# EAGLE design base-1u-video (EAGLE 4.16)
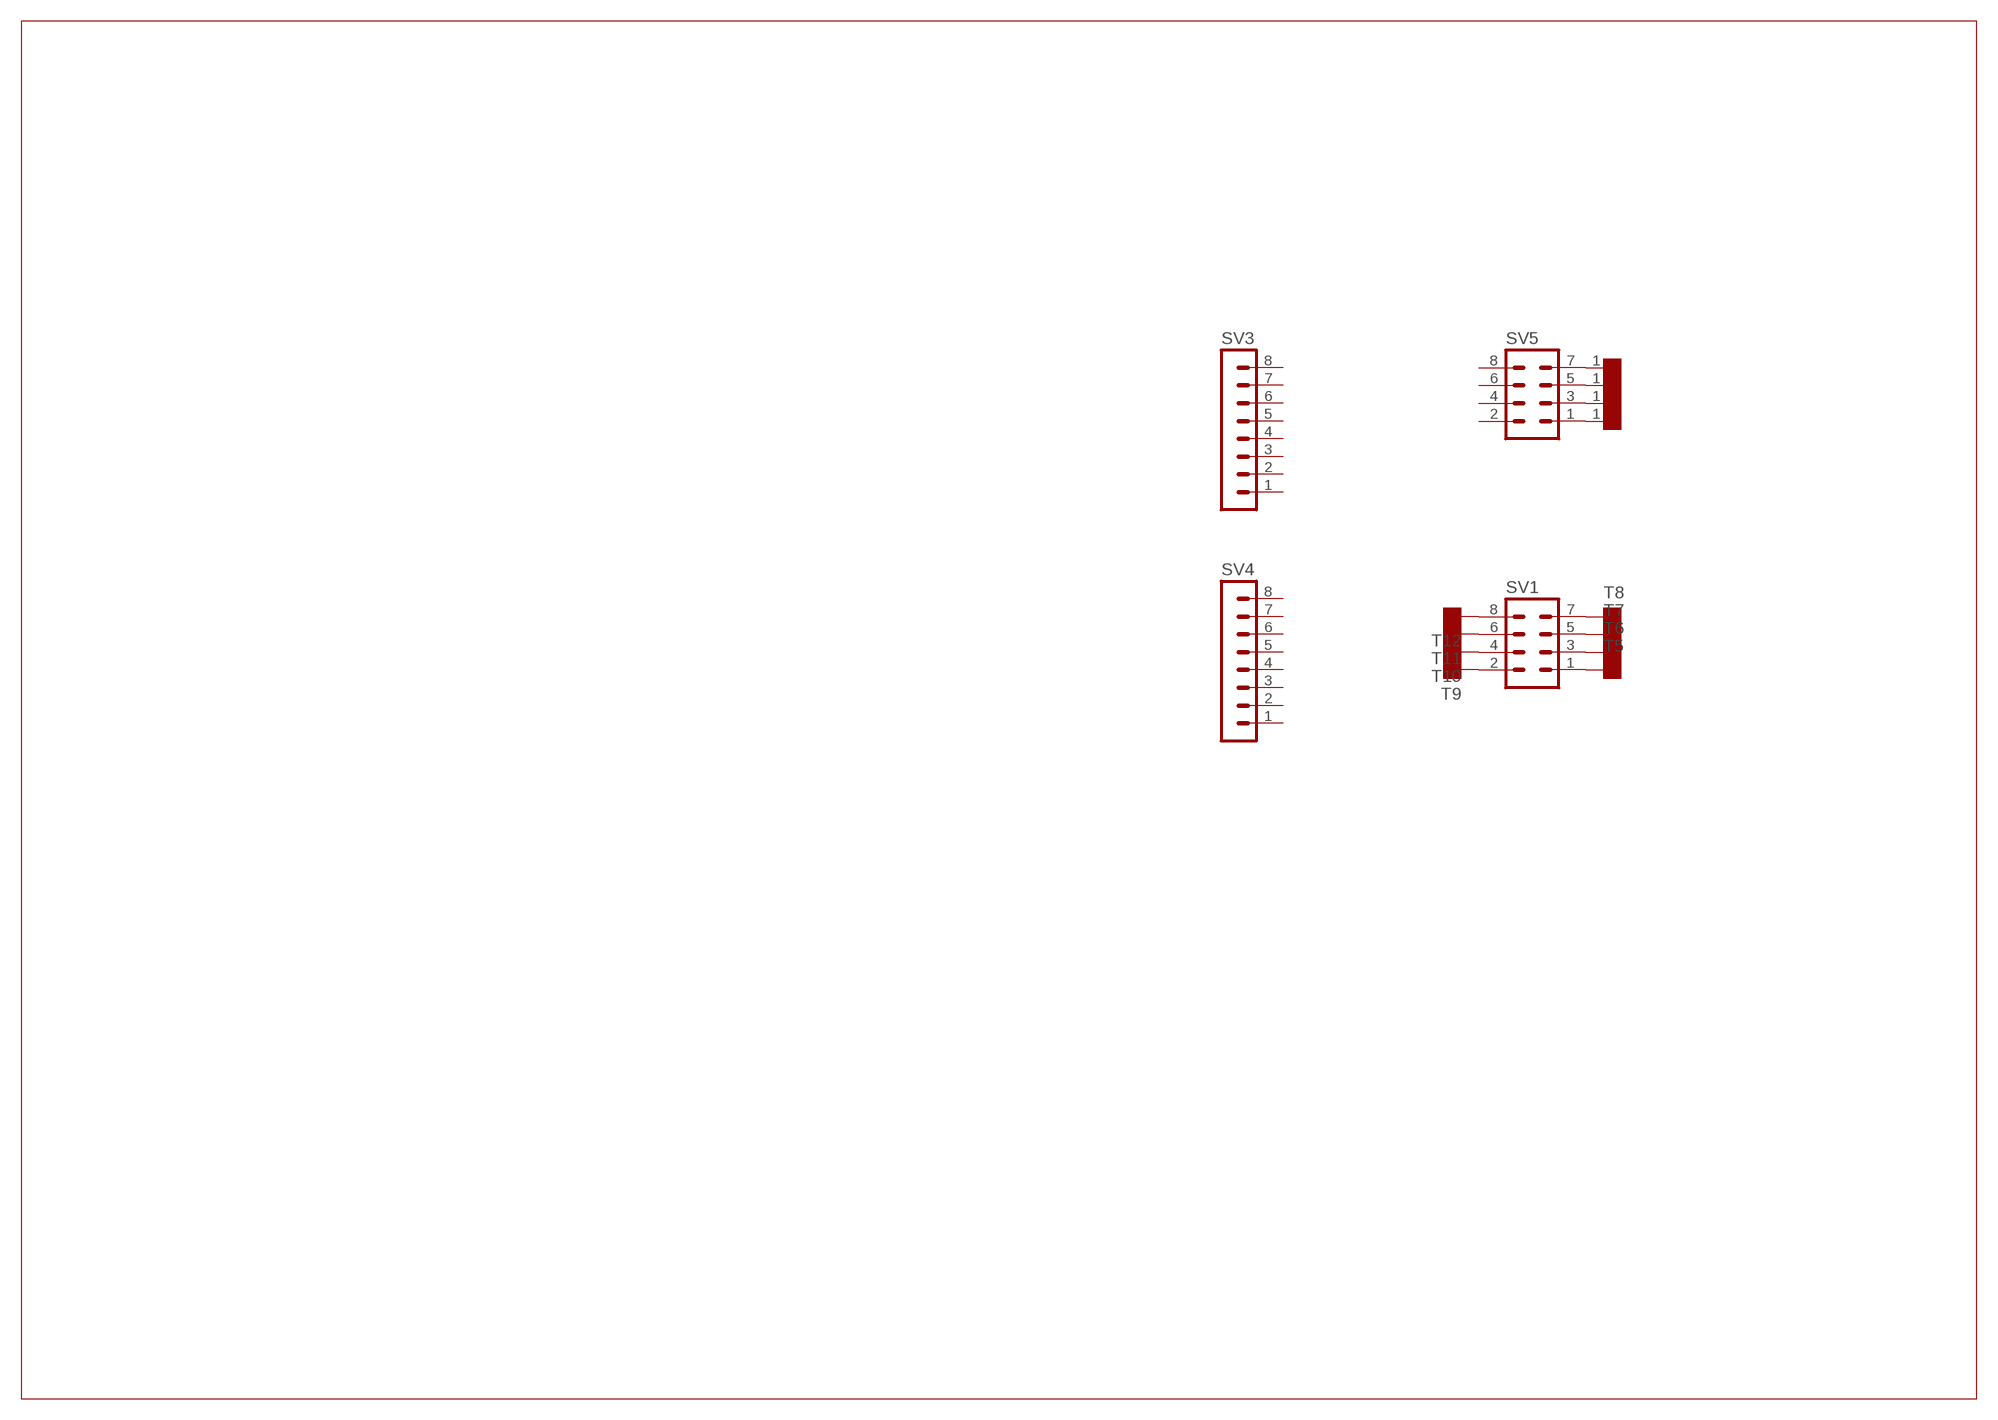
[diagram p0: schematic, sheet 1]

## Parts
SV1  MA04-2  [MA04-2]
SV3  MA08-1  [MA08-1]
SV4  MA08-1  [MA08-1]
SV5  MA04-2  [MA04-2]
T1  TESTPOINT  [TESTPOIN]
T2  TESTPOINT  [TESTPOIN]
T3  TESTPOINT  [TESTPOIN]
T4  TESTPOINT  [TESTPOIN]
T5  TESTPOINTAWG24  [HOLEAWG24]
T6  TESTPOINTAWG24  [HOLEAWG24]
T7  TESTPOINTAWG24  [HOLEAWG24]
T8  TESTPOINTAWG24  [HOLEAWG24]
T9  TESTPOINTAWG24  [HOLEAWG24]
T10  TESTPOINTAWG24  [HOLEAWG24]
T11  TESTPOINTAWG24  [HOLEAWG24]
T12  TESTPOINTAWG24  [HOLEAWG24]

## Nets
N$129: SV1.1 T5.P$1
N$130: SV1.3 T6.P$1
N$131: SV1.5 T7.P$1
N$132: SV1.7 T8.P$1
N$133: SV1.2 T9.P$1
N$134: SV1.4 T10.P$1
N$135: SV1.6 T11.P$1
N$136: SV1.8 T12.P$1
N$137: SV5.1 T1.1
N$138: SV5.3 T2.1
N$139: SV5.5 T3.1
N$140: SV5.7 T4.1
Unconnected: SV3.1 SV3.2 SV3.3 SV3.4 SV3.5 SV3.6 SV3.7 SV3.8 SV4.1 SV4.2 SV4.3 SV4.4 SV4.5 SV4.6 SV4.7 SV4.8 SV5.2 SV5.4 SV5.6 SV5.8

## Library data of the parts
SV1 SV5 = con-lstb:MA04-2: PIN HEADER
SV3 SV4 = con-lstb:MA08-1: PIN HEADER
T1-T4 = ADS:TESTPOINT
T5-T12 = ads4:TESTPOINT: Test point

## Board
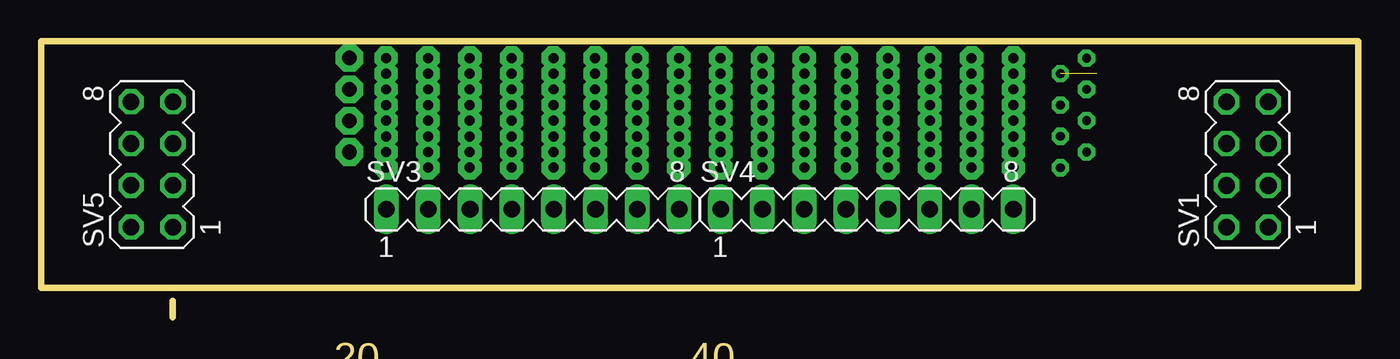
[diagram p1: board, top side]
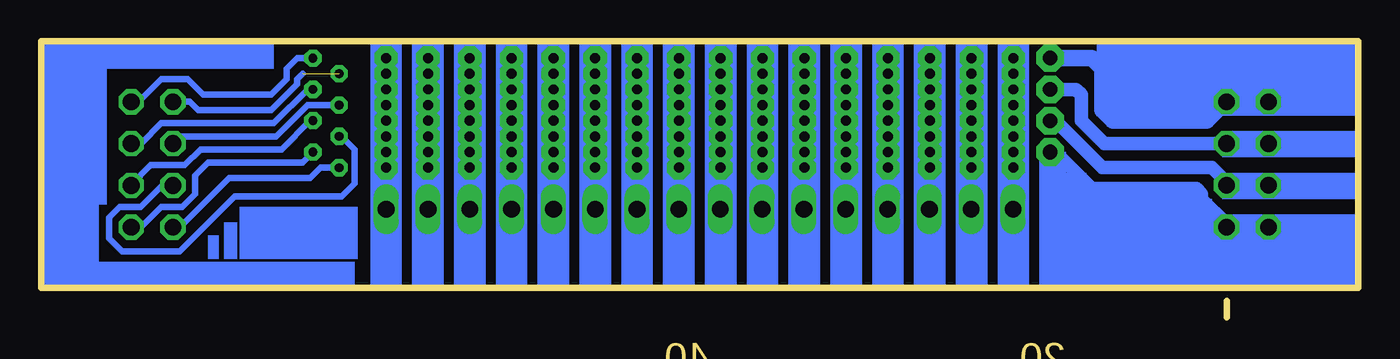
[diagram p2: board, bottom side, seen from below]

Size 80 x 16.8 mm. Coordinates in mm from the lower left corner, seen from the top.
Outline: 8,1 8,0
Outline: 0,1.8 80,1.8 80,16.8 0,16.8 0,1.8
Copper layers (1*16): Top 0.035mm / dielectric 1.5mm / Bottom 0.035mm
Design rules "default": minimum track width 10mil, minimum drill 24mil, track to track 8mil, track to pad 8mil, pad to pad 8mil, via to via 8mil, smd to smd 8mil, copper to edge 40mil, drill to drill 8mil, minimum pad ring 10mil, minimum via ring 8mil, stop-mask expansion 4mil, vias tented up to drill 0mil, thermal gap 10mil

### Footprints (pad centres in the part's own frame; a part is rotated, then mirrored left to right if it is on the bottom)
MA04-2 = drill 1.016 octagon: 1 -3.81,-1.27; 2 -3.81,1.27; 3 -1.27,-1.27; 4 -1.27,1.27; 5 1.27,-1.27; 6 1.27,1.27; 7 3.81,-1.27; 8 3.81,1.27
MA08-1 = drill 1.016 long: 1 -8.89,0; 2 -6.35,0; 3 -3.81,0; 4 -1.27,0; 5 1.27,0; 6 3.81,0; 7 6.35,0; 8 8.89,0
TESTPOIN = drill 0.889 pad 1.676 octagon: 1 0,0
HOLEAWG24 = drill 0.533 pad 0.787 octagon: P$1 0,0

### Placement (x,y rotation side)
SV1  73.27,9.3 90 top
SV3  29.86,6.57 0 top
SV4  50.16,6.57 0 top
SV5  6.73,9.3 90 top
T1  18.73,10.06 0 top
T2  18.73,11.96 0 top
T3  18.73,13.87 0 top
T4  18.73,15.77 0 top
T5  63.5,10.06 0 top
T6  63.5,11.96 0 top
T7  63.5,13.87 0 top
T8  63.5,15.77 0 top
T9  61.91,9.1 0 top
T10  61.91,11.01 0 top
T11  61.91,12.91 0 top
T12  61.91,14.82 0 top

### Tracks (layer width: path | path; a pad name or v marks a point on that pad's centre or on a via)
N$1  (via drill 0.6 pad 1.42)
  other vias: 20.95,9.1
N$2  (via drill 0.6 pad 1.42)
  other vias: 20.95,10.06
N$3  (via drill 0.6 pad 1.42)
  other vias: 20.95,11.01
N$4  (via drill 0.6 pad 1.42)
  other vias: 20.95,11.96
N$5  (via drill 0.6 pad 1.42)
  other vias: 23.5,9.1
N$6  (via drill 0.6 pad 1.42)
  other vias: 23.5,11.01
N$7  (via drill 0.6 pad 1.42)
  other vias: 23.5,12.91
N$8  (via drill 0.6 pad 1.42)
  other vias: 23.5,14.82
N$9  (via drill 0.6 pad 1.42)
  other vias: 20.95,12.91
N$10  (via drill 0.6 pad 1.42)
  other vias: 20.95,13.87
N$11  (via drill 0.6 pad 1.42)
  other vias: 20.95,14.82
N$12  (via drill 0.6 pad 1.42)
  other vias: 20.95,15.77
N$13  (via drill 0.6 pad 1.42)
  other vias: 33.66,9.1
N$14  (via drill 0.6 pad 1.42)
  other vias: 33.66,11.01
N$15  (via drill 0.6 pad 1.42)
  other vias: 33.66,12.91
N$16  (via drill 0.6 pad 1.42)
  other vias: 33.66,14.82
N$17  (via drill 0.6 pad 1.42)
  other vias: 23.5,15.77
N$18  (via drill 0.6 pad 1.42)
  other vias: 23.5,13.87
N$19  (via drill 0.6 pad 1.42)
  other vias: 23.5,11.96
N$20  (via drill 0.6 pad 1.42)
  other vias: 23.5,10.06
N$21  (via drill 0.6 pad 1.42)
  other vias: 33.66,15.77
N$22  (via drill 0.6 pad 1.42)
  other vias: 33.66,13.87
N$23  (via drill 0.6 pad 1.42)
  other vias: 33.66,11.96
N$24  (via drill 0.6 pad 1.42)
  other vias: 33.66,10.06
N$25  (via drill 0.6 pad 1.42)
  other vias: 31.11,9.1
N$26  (via drill 0.6 pad 1.42)
  other vias: 31.11,10.06
N$27  (via drill 0.6 pad 1.42)
  other vias: 31.11,11.01
N$28  (via drill 0.6 pad 1.42)
  other vias: 31.11,11.96
N$29  (via drill 0.6 pad 1.42)
  other vias: 38.73,9.1
N$30  (via drill 0.6 pad 1.42)
  other vias: 38.73,10.06
N$31  (via drill 0.6 pad 1.42)
  other vias: 38.73,11.01
N$32  (via drill 0.6 pad 1.42)
  other vias: 38.73,11.96
N$33  (via drill 0.6 pad 1.42)
  other vias: 41.27,9.1
N$34  (via drill 0.6 pad 1.42)
  other vias: 41.27,11.01
N$35  (via drill 0.6 pad 1.42)
  other vias: 41.27,12.91
N$36  (via drill 0.6 pad 1.42)
  other vias: 41.27,14.82
N$37  (via drill 0.6 pad 1.42)
  other vias: 43.81,10.06
N$38  (via drill 0.6 pad 1.42)
  other vias: 43.81,11.96
N$39  (via drill 0.6 pad 1.42)
  other vias: 43.81,13.87
N$40  (via drill 0.6 pad 1.42)
  other vias: 43.81,15.77
N$41  (via drill 0.6 pad 1.42)
  other vias: 46.35,9.1
N$42  (via drill 0.6 pad 1.42)
  other vias: 46.35,11.01
N$43  (via drill 0.6 pad 1.42)
  other vias: 46.35,12.91
N$44  (via drill 0.6 pad 1.42)
  other vias: 46.35,14.82
N$45  (via drill 0.6 pad 1.42)
  other vias: 48.9,10.06
N$46  (via drill 0.6 pad 1.42)
  other vias: 48.9,11.96
N$47  (via drill 0.6 pad 1.42)
  other vias: 48.9,9.1
N$48  (via drill 0.6 pad 1.42)
  other vias: 48.9,11.01
N$49  (via drill 0.6 pad 1.42)
  other vias: 48.9,12.91
N$50  (via drill 0.6 pad 1.42)
  other vias: 48.9,13.87
N$51  (via drill 0.6 pad 1.42)
  other vias: 48.9,14.82
N$52  (via drill 0.6 pad 1.42)
  other vias: 48.9,15.77
N$53  (via drill 0.6 pad 1.42)
  other vias: 46.35,10.06
N$54  (via drill 0.6 pad 1.42)
  other vias: 46.35,11.96
N$55  (via drill 0.6 pad 1.42)
  other vias: 46.35,13.87
N$56  (via drill 0.6 pad 1.42)
  other vias: 46.35,15.77
N$57  (via drill 0.6 pad 1.42)
  other vias: 51.44,9.1
N$58  (via drill 0.6 pad 1.42)
  other vias: 51.44,10.06
N$59  (via drill 0.6 pad 1.42)
  other vias: 51.44,11.01
N$60  (via drill 0.6 pad 1.42)
  other vias: 51.44,11.96
N$61  (via drill 0.6 pad 1.42)
  other vias: 51.44,12.91
N$62  (via drill 0.6 pad 1.42)
  other vias: 51.44,13.87
N$63  (via drill 0.6 pad 1.42)
  other vias: 51.44,14.82
N$64  (via drill 0.6 pad 1.42)
  other vias: 51.44,15.77
N$65  (via drill 0.6 pad 1.42)
  other vias: 53.98,9.1
N$66  (via drill 0.6 pad 1.42)
  other vias: 53.98,10.06
N$67  (via drill 0.6 pad 1.42)
  other vias: 53.98,11.01
N$68  (via drill 0.6 pad 1.42)
  other vias: 53.98,11.96
N$69  (via drill 0.6 pad 1.42)
  other vias: 53.98,12.91
N$70  (via drill 0.6 pad 1.42)
  other vias: 53.98,13.87
N$71  (via drill 0.6 pad 1.42)
  other vias: 53.98,14.82
N$72  (via drill 0.6 pad 1.42)
  other vias: 53.98,15.77
N$73  (via drill 0.6 pad 1.42)
  other vias: 56.52,9.1
N$74  (via drill 0.6 pad 1.42)
  other vias: 56.52,10.06
N$75  (via drill 0.6 pad 1.42)
  other vias: 56.52,11.01
N$76  (via drill 0.6 pad 1.42)
  other vias: 56.52,11.96
N$77  (via drill 0.6 pad 1.42)
  other vias: 56.52,12.91
N$78  (via drill 0.6 pad 1.42)
  other vias: 56.52,13.87
N$79  (via drill 0.6 pad 1.42)
  other vias: 56.52,14.82
N$80  (via drill 0.6 pad 1.42)
  other vias: 56.52,15.77
N$81  (via drill 0.6 pad 1.42)
  other vias: 59.05,9.1
N$82  (via drill 0.6 pad 1.42)
  other vias: 59.05,10.06
N$83  (via drill 0.6 pad 1.42)
  other vias: 59.05,11.01
N$84  (via drill 0.6 pad 1.42)
  other vias: 59.05,11.96
N$85  (via drill 0.6 pad 1.42)
  other vias: 59.05,12.91
N$86  (via drill 0.6 pad 1.42)
  other vias: 59.05,13.87
N$87  (via drill 0.6 pad 1.42)
  other vias: 59.05,14.82
N$88  (via drill 0.6 pad 1.42)
  other vias: 59.05,15.77
N$89  (via drill 0.6 pad 1.42)
  other vias: 43.81,9.1
N$90  (via drill 0.6 pad 1.42)
  other vias: 43.81,11.01
N$91  (via drill 0.6 pad 1.42)
  other vias: 43.81,12.91
N$92  (via drill 0.6 pad 1.42)
  other vias: 43.81,14.82
N$93  (via drill 0.6 pad 1.42)
  other vias: 41.27,10.06
N$94  (via drill 0.6 pad 1.42)
  other vias: 41.27,11.96
N$95  (via drill 0.6 pad 1.42)
  other vias: 41.27,13.87
N$96  (via drill 0.6 pad 1.42)
  other vias: 41.27,15.77
N$97  (via drill 0.6 pad 1.42)
  other vias: 28.57,9.1
N$98  (via drill 0.6 pad 1.42)
  other vias: 28.57,11.01
N$99  (via drill 0.6 pad 1.42)
  other vias: 28.57,12.91
N$100  (via drill 0.6 pad 1.42)
  other vias: 28.57,14.82
N$101  (via drill 0.6 pad 1.42)
  other vias: 28.57,15.77
N$102  (via drill 0.6 pad 1.42)
  other vias: 28.57,13.87
N$103  (via drill 0.6 pad 1.42)
  other vias: 28.57,11.96
N$104  (via drill 0.6 pad 1.42)
  other vias: 28.57,10.06
N$105  (via drill 0.6 pad 1.42)
  other vias: 31.11,12.91
N$106  (via drill 0.6 pad 1.42)
  other vias: 31.11,13.87
N$107  (via drill 0.6 pad 1.42)
  other vias: 31.11,14.82
N$108  (via drill 0.6 pad 1.42)
  other vias: 31.11,15.77
N$109  (via drill 0.6 pad 1.42)
  other vias: 26.04,9.1
N$110  (via drill 0.6 pad 1.42)
  other vias: 26.04,10.06
N$111  (via drill 0.6 pad 1.42)
  other vias: 26.04,11.01
N$112  (via drill 0.6 pad 1.42)
  other vias: 26.04,11.96
N$113  (via drill 0.6 pad 1.42)
  other vias: 26.04,12.91
N$114  (via drill 0.6 pad 1.42)
  other vias: 26.04,13.87
N$115  (via drill 0.6 pad 1.42)
  other vias: 26.04,14.82
N$116  (via drill 0.6 pad 1.42)
  other vias: 26.04,15.77
N$117  (via drill 0.6 pad 1.42)
  other vias: 36.2,9.1
N$118  (via drill 0.6 pad 1.42)
  other vias: 36.2,10.06
N$119  (via drill 0.6 pad 1.42)
  other vias: 36.2,11.01
N$120  (via drill 0.6 pad 1.42)
  other vias: 36.2,11.96
N$121  (via drill 0.6 pad 1.42)
  other vias: 36.2,12.91
N$122  (via drill 0.6 pad 1.42)
  other vias: 36.2,13.87
N$123  (via drill 0.6 pad 1.42)
  other vias: 36.2,14.82
N$124  (via drill 0.6 pad 1.42)
  other vias: 36.2,15.77
N$125  (via drill 0.6 pad 1.42)
  other vias: 38.73,12.91
N$126  (via drill 0.6 pad 1.42)
  other vias: 38.73,13.87
N$127  (via drill 0.6 pad 1.42)
  other vias: 38.73,14.82
N$128  (via drill 0.6 pad 1.42)
  other vias: 38.73,15.77
N$129
  Bottom 0.406: SV1.1 73.94,5.49 72.71,6.72 71.44,6.72 70.64,7.51 70.64,8.63 69.85,9.42 64.14,9.42 T5.P$1
N$130
  Bottom 0.406: T6.P$1 63.66,11.96 65.41,10.21 70.33,10.21 71.28,9.26 73.34,9.26 74.58,8.03 | 74.61,7.99 74.58,8.03 | 74.58,8.03 SV1.3
N$131
  Bottom 0.406: SV1.5 73.94,10.57 72.71,11.8 65.88,11.8 63.82,13.87 T7.P$1
N$132
  Bottom 0.406: SV1.7 74.1,13.11 72.71,14.5 71.12,14.5 70.17,13.55 66.04,13.55 65.09,14.5 65.09,15.14 64.45,15.77 T8.P$1
N$133
  Bottom 0.406: T9.P$1 63.02,9.1 63.66,8.47 68.58,8.47 71.44,5.61 71.75,5.61 71.91,5.45 71.95,5.49 SV1.2
N$134
  Bottom 0.406: T10.P$1 61.75,11.01 60.96,10.21 60.96,8.15 61.75,7.36 68.26,7.36 71.6,4.02 75.09,4.02 75.88,4.82 75.88,6.09 75.25,6.72 73.98,6.72 72.67,8.03 SV1.4
N$135
  Bottom 0.406: T11.P$1 63.82,12.91 65.72,11.01 71.44,11.01 71.91,10.53 71.95,10.57 SV1.6
N$136  (1 unrouted)
  Bottom 0.406: SV1.8 71,13.11 70.48,12.6 66.04,12.6 64.45,14.18 64.45,14.5 64.14,14.82
N$137
  Bottom 0.813: SV5.1 8,5.67 9.53,7.2 9.53,7.51 9.84,7.83 16.19,7.83 18.41,10.06 T1.1
N$138
  Bottom 0.813: SV5.3 8,8.21 8.89,9.1 15.56,9.1 18.41,11.96 T2.1
N$139
  Bottom 0.813: SV5.5 15.44,10.57 16.83,11.96 16.83,13.55 17.14,13.87 T3.1
N$140
  Bottom 1.016: SV5.7 8.06,13.11 9.21,11.96 14.92,11.96 15.56,12.6 15.56,15.14 16.19,15.77 T4.1
(copper drawn outside any net)
  shapes: Bottom area x31

### Text on the board
Dimension: 20 | 40
tOrigins: 37 | 6.73 | 7.5 | 6.04 | 3.5 | 80